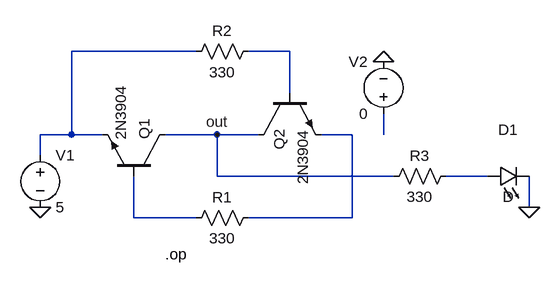
[diagram p0: schematic mydubiousOR.asc]
mydubiousOR.asc, the LTspice schematic file:
Version 4
SHEET 1 880 680
WIRE 256 16 64 16
WIRE 400 16 336 16
WIRE 400 80 400 16
WIRE 64 144 64 16
WIRE 64 144 16 144
WIRE 112 144 64 144
WIRE 288 144 208 144
WIRE 352 144 288 144
WIRE 496 144 448 144
WIRE 544 144 544 112
WIRE 16 176 16 144
WIRE 288 208 288 144
WIRE 560 208 288 208
WIRE 704 208 640 208
WIRE 768 256 768 208
WIRE 160 272 160 208
WIRE 256 272 160 272
WIRE 496 272 496 144
WIRE 496 272 336 272
FLAG 16 256 0
FLAG 544 32 0
FLAG 768 256 0
FLAG 288 144 out
SYMBOL npn 208 208 M270
SYMATTR InstName Q1
SYMATTR Value 2N3904
SYMBOL npn 352 80 M90
SYMATTR InstName Q2
SYMATTR Value 2N3904
SYMBOL res 352 256 R90
WINDOW 0 0 56 VBottom 2
WINDOW 3 32 56 VTop 2
SYMATTR InstName R1
SYMATTR Value 330
SYMBOL res 352 0 R90
WINDOW 0 0 56 VBottom 2
WINDOW 3 32 56 VTop 2
SYMATTR InstName R2
SYMATTR Value 330
SYMBOL voltage 16 160 R0
WINDOW 123 0 0 Left 0
WINDOW 39 0 0 Left 0
SYMATTR InstName V1
SYMATTR Value 5
SYMBOL voltage 544 128 R180
WINDOW 0 24 96 Left 2
WINDOW 3 24 16 Left 2
WINDOW 123 0 0 Left 0
WINDOW 39 0 0 Left 0
SYMATTR InstName V2
SYMATTR Value 0
SYMBOL res 656 192 R90
WINDOW 0 0 56 VBottom 2
WINDOW 3 32 56 VTop 2
SYMATTR InstName R3
SYMATTR Value 330
SYMBOL LED 704 224 R270
WINDOW 0 72 32 VTop 2
WINDOW 3 0 32 VBottom 2
SYMATTR InstName D1
TEXT 208 328 Left 2 !.op

The netlist it stands for:
* mydubiousOR.asc
Q1 out N006 N001 0 2N3904
Q2 out N002 N003 0 2N3904
R1 N003 N006 330
R2 N002 N001 330
V1 N001 0 5
V2 N004 0 0
R3 N005 out 330
D1 N005 0 D
.model D D
.lib standard.dio
.model NPN NPN
.model PNP PNP
.lib standard.bjt
.op
.backanno
.end